# Altium project BusinessCard.PrjPcb
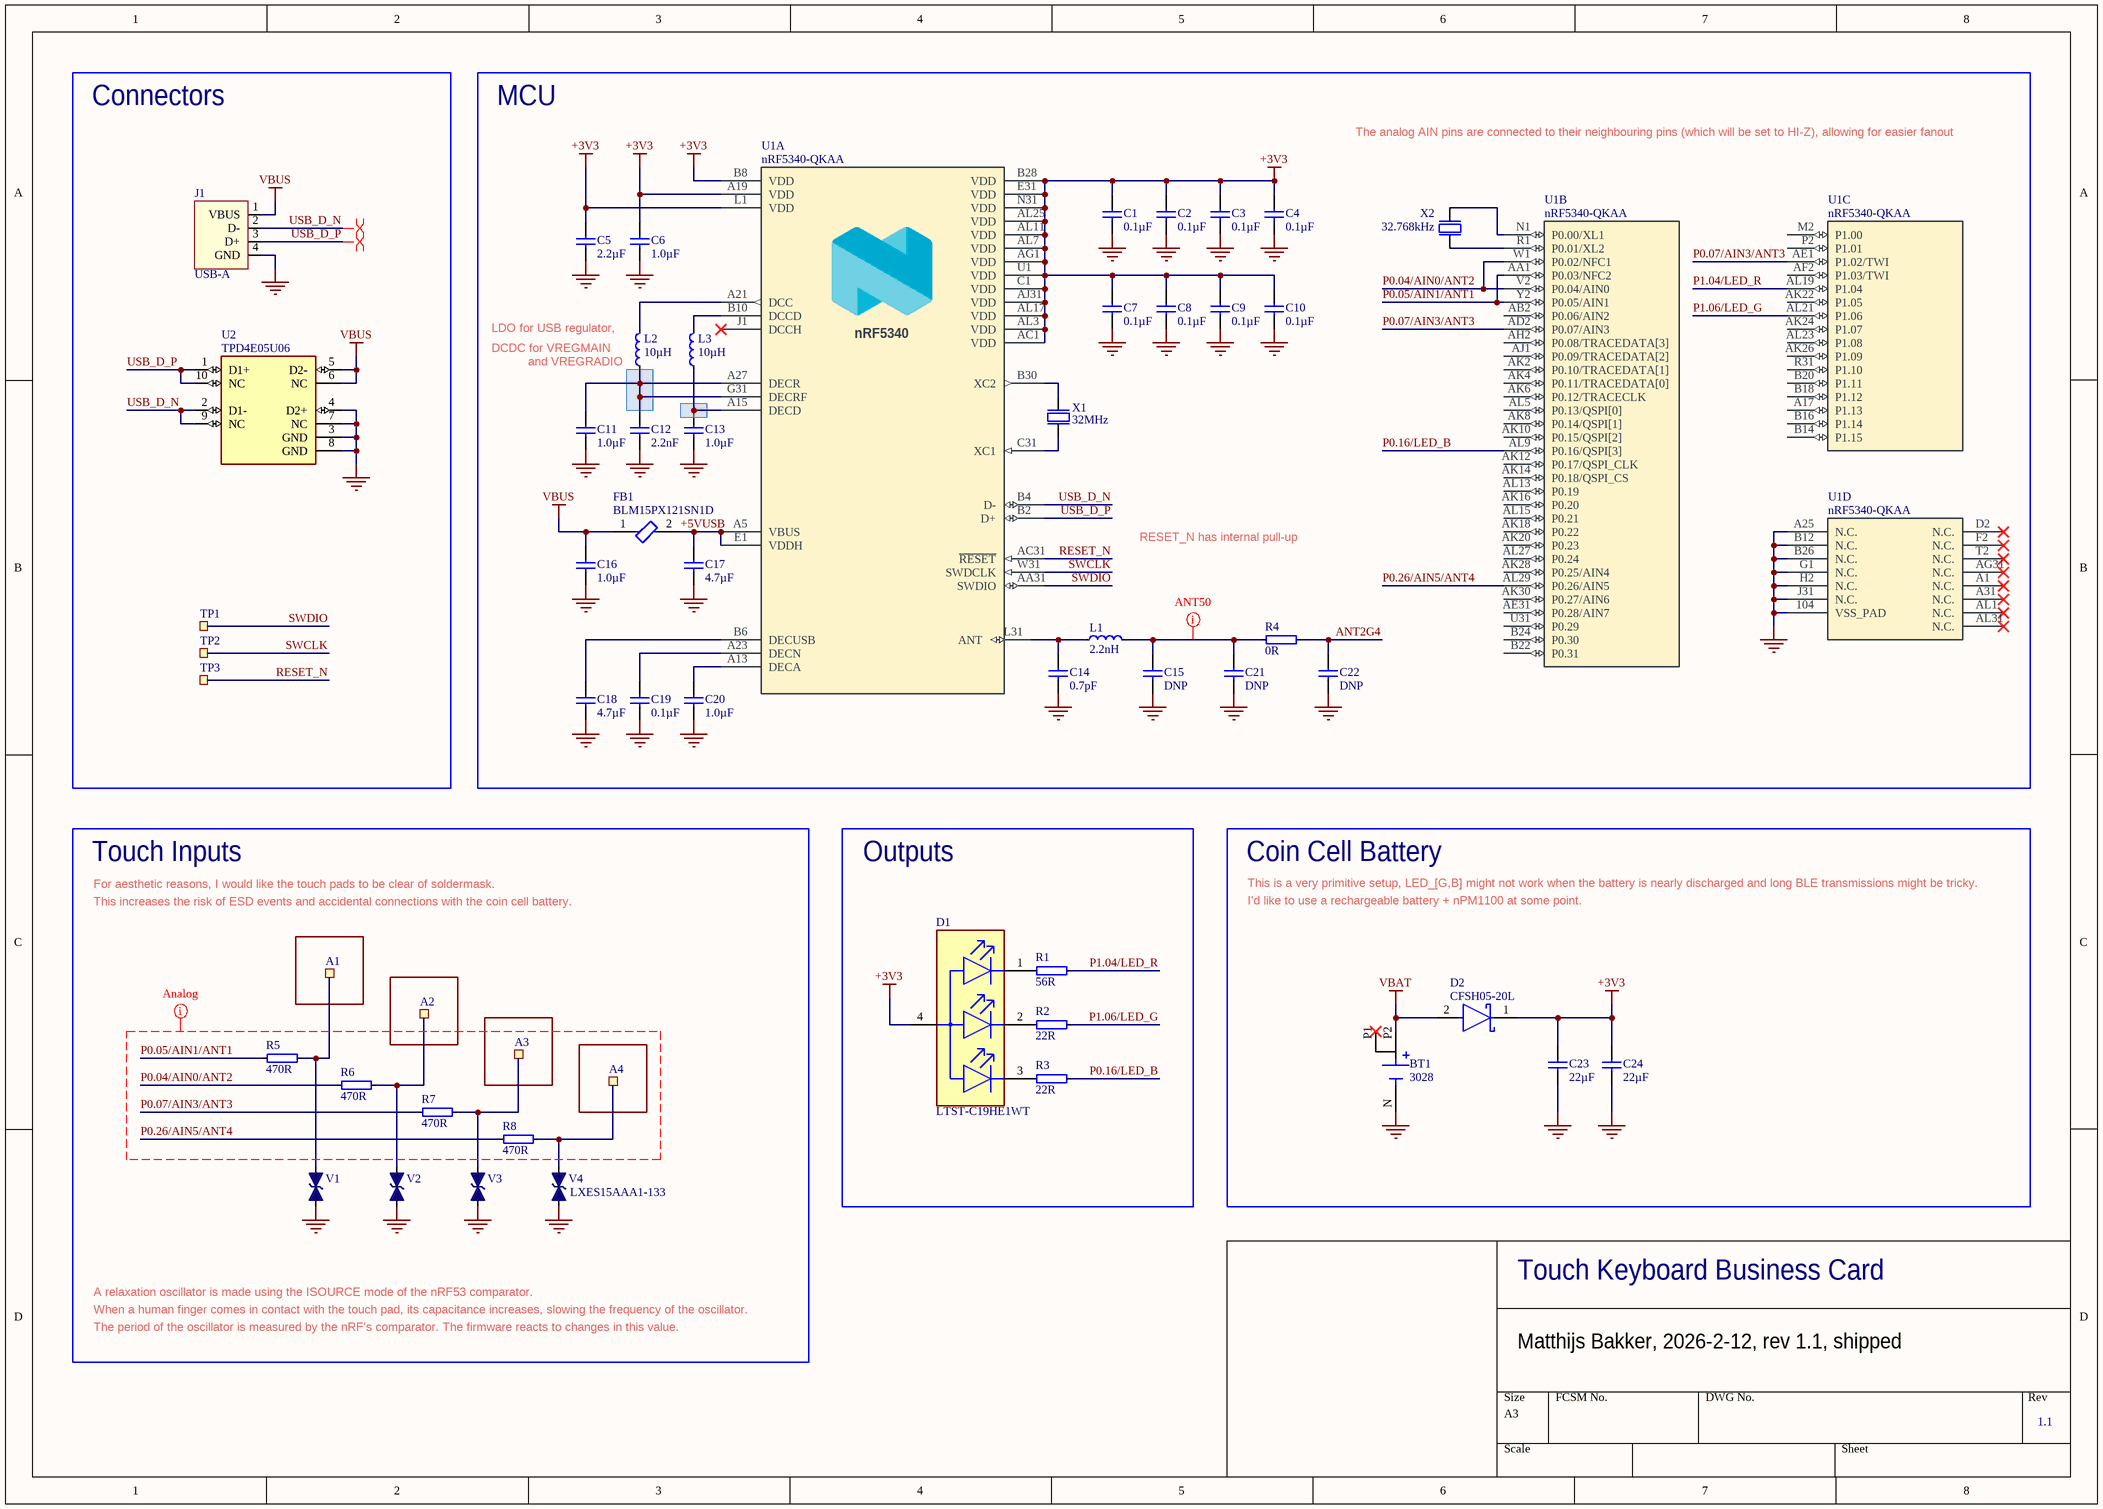
[diagram p0: BusinessCard.SchDoc]
1 sheet, 55 parts. Net scope: global (net labels, ports and power ports of the same name join across sheets).
Board file: BusinessCard.PcbDoc

## Sheet BusinessCard.SchDoc: Business Card
size A3; DrawnBy: Matthijs Bakker; SheetNumber: 1; SheetTotal: 1

### Parts
A1  Ø1.0mm,SMD  [TP_SMD_Ø1.0mm]  (value not drawn)  (no BOM)
A2  Ø1.0mm,SMD  [TP_SMD_Ø1.0mm]  (value not drawn)  (no BOM)
A3  Ø1.0mm,SMD  [TP_SMD_Ø1.0mm]  (value not drawn)  (no BOM)
A4  Ø1.0mm,SMD  [TP_SMD_Ø1.0mm]  (value not drawn)  (no BOM)
BT1  3028  [BAT_3028]
C1  0.1µF  [CAPC1005X04L]
C2  0.1µF  [CAPC1005X04L]
C3  0.1µF  [CAPC1005X04L]
C4  0.1µF  [CAPC1005X04L]
C5  2.2µF  [CAPC1005X04L]
C6  1.0µF  [CAPC1005X04L]
C7  0.1µF  [CAPC1005X04L]
C8  0.1µF  [CAPC1005X04L]
C9  0.1µF  [CAPC1005X04L]
C10  0.1µF  [CAPC1005X04L]
C11  1.0µF  [CAPC1005X04L]
C12  2.2nF  [CAPC1005X04L]
C13  1.0µF  [CAPC1005X04L]
C14  0.7pF  [CAPC1005X04L]
C15  DNP  [CAPC1005X04L]
C16  1.0µF  [CAPC1005X04L]
C17  4.7µF  [CAPC1608X06L]
C18  4.7µF  [CAPC1608X06L]
C19  0.1µF  [CAPC1005X04L]
C20  1.0µF  [CAPC1005X04L]
C21  DNP  [CAPC1005X04L]
C22  DNP  [CAPC1005X04L]
C23  22µF  [CAPC1608X06L]
C24  22µF  [CAPC1608X06L]
D1  LTST-C19HE1WT  [FP-LTST-C19HE1WT-MFG]
D2  CFSH05-20L  [FP-SOD-882L-MFG]
FB1  BLM15PX121SN1D  [FP-BLM15-0_05-d0_7-MFG]
J1  USB-A  [USB-A-PCB]  (no BOM)
L1  2.2nH  [INDC1005X04L]
L2  10µH  [INDC1608X06L]
L3  10µH  [INDC1608X06L]
R1  56R  [RESC1005X04L]
R2  22R  [RESC1005X04L]
R3  22R  [RESC1005X04L]
R4  0R  [RESC1005X04L]
R5  470R  [RESC1005X04L]
R6  470R  [RESC1005X04L]
R7  470R  [RESC1005X04L]
R8  470R  [RESC1005X04L]
TP1  Ø1.0mm,SMD  [TP_SMD_Ø1.0mm]  (value not drawn)  (no BOM)
TP2  Ø1.0mm,SMD  [TP_SMD_Ø1.0mm]  (value not drawn)  (no BOM)
TP3  Ø1.0mm,SMD  [TP_SMD_Ø1.0mm]  (value not drawn)  (no BOM)
U1  nRF5340-QKAA  [AQFN40P700X700X85_HS-99N]  (parts A,B,C,D of 4)
U2  TPD4E05U06  [FP-DQA0010A-MFG]
V1  LXES15AAA1-133  [RESC1005X04L]  (value not drawn)
V2  LXES15AAA1-133  [RESC1005X04L]  (value not drawn)
V3  LXES15AAA1-133  [RESC1005X04L]  (value not drawn)
V4  LXES15AAA1-133  [RESC1005X04L]
X1  32MHz  [BT-XTAL_1612]
X2  32.768kHz  [XTAL_2012]

### Blocks framed on the sheet
Connectors: J1 TP1-TP3 U2
MCU: C1-C22 FB1 L1-L3 R4 U1 X1 X2
Touch Inputs: A1-A4 R5-R8 V1-V4
Outputs: D1 R1-R3
Coin Cell Battery: BT1 C23 C24 D2

### Nets
+3V3: C1.2 C2.2 C3.2 C4.2 C5.2 C6.2 C7.2 C8.2 C9.2 C10.2 C23.2 C24.2 D1.4(A) D2.1(C) U1.A19(VDD) U1.AC1(VDD) U1.AG1(VDD) U1.AJ31(VDD) U1.AL3(VDD) U1.AL7(VDD) U1.AL11(VDD) U1.AL17(VDD) U1.AL25(VDD) U1.B8(VDD) U1.B28(VDD) U1.C1(VDD) U1.E31(VDD) U1.L1(VDD) U1.N31(VDD) U1.U1(VDD)
GND: BT1.N(NEG) C1.1 C2.1 C3.1 C4.1 C5.1 C6.1 C7.1 C8.1 C9.1 C10.1 C11.2 C12.1 C13.1 C14.1 C15.1 C16.2 C17.1 C18.1 C19.1 C20.1 C21.1 C22.1 C23.1 C24.1 J1.4(GND) U1.104(VSS_PAD) U1.A25(N.C.) U1.B12(N.C.) U1.B26(N.C.) U1.G1(N.C.) U1.H2(N.C.) U1.J31(N.C.) U2.3(GND) U2.4(D2+) U2.7(NC) U2.8(GND) V1.1 V2.1 V3.1 V4.1 X1.2(GND) X1.4(GND)
VBAT: BT1.P2(POS) D2.2(A)
VBUS: C16.1 FB1.1 J1.1(VBUS) U2.5(D2-) U2.6(NC)
+5VUSB: C17.2 FB1.2 U1.A5(VBUS) U1.E1(VDDH)
ANT2G4: C22.2 R4.2
P0.04/AIN0/ANT2: R6.1 U1.V2(P0.04/AIN0) U1.W1(P0.02/NFC1)
P0.05/AIN1/ANT1: R5.1 U1.AA1(P0.03/NFC2) U1.Y2(P0.05/AIN1)
P0.07/AIN3/ANT3: R7.1 U1.AD2(P0.07/AIN3) U1.AE1(P1.02/TWI)
P0.16/LED_B: R3.2 U1.AL9(P0.16/QSPI[3])
P0.26/AIN5/ANT4: R8.1 U1.AL29(P0.26/AIN5)
P1.04/LED_R: R1.2 U1.AL19(P1.04)
P1.06/LED_G: R2.2 U1.AL21(P1.06)
RESET_N: TP3.1 U1.AC31(~{RESET})
SWCLK: TP2.1 U1.W31(SWDCLK)
SWDIO: TP1.1 U1.AA31(SWDIO)
USB_D_N: J1.2(D-) U1.B4(D-) U2.2(D1-) U2.9(NC)
USB_D_P: J1.3(D+) U1.B2(D+) U2.1(D1+) U2.10(NC)
NetA1_1: A1.1 R5.2 V1.2
NetA2_1: A2.1 R6.2 V2.2
NetA3_1: A3.1 R7.2 V3.2
NetA4_1: A4.1 R8.2 V4.2
NetC11_1: C11.1 C12.2 L2.1 U1.A27(DECR) U1.G31(DECRF)
NetC13_2: C13.2 L3.1 U1.A15(DECD)
NetC14_2: C14.2 L1.1 U1.L31(ANT)
NetC15_2: C15.2 C21.2 L1.2 R4.1
NetC18_2: C18.2 U1.B6(DECUSB)
NetC19_2: C19.2 U1.A23(DECN)
NetC20_2: C20.2 U1.A13(DECA)
NetD1_1: D1.1(RED_C) R1.1
NetD1_2: D1.2(GREEN_C) R2.1
NetD1_3: D1.3(BLUE_C) R3.1
NetL2_2: L2.2 U1.A21(DCC)
NetL3_2: L3.2 U1.B10(DCCD)
NetU1_B30: U1.B30(XC2) X1.3(out)
NetU1_C31: U1.C31(XC1) X1.1(inp)
NetU1_N1: U1.N1(P0.00/XL1) X2.2(out)
NetU1_R1: U1.R1(P0.01/XL2) X2.1(inp)

Not connected (* = marked no-connect by the designer): BT1 P1(POS)*; U1 A1(N.C.)* A17(P1.13) A31(N.C.)* AB2(P0.06/AIN2) AE31(P0.28/AIN7) AF2(P1.03/TWI) AG31(N.C.)* AH2(P0.08/TRACEDATA[3]) AJ1(P0.09/TRACEDATA[2]) AK2(P0.10/TRACEDATA[1]) AK4(P0.11/TRACEDATA[0]) AK6(P0.12/TRACECLK) AK8(P0.14/QSPI[1]) AK10(P0.15/QSPI[2]) AK12(P0.17/QSPI_CLK) AK14(P0.18/QSPI_CS) AK16(P0.20) AK18(P0.22) AK20(P0.23) AK22(P1.05) AK24(P1.07) AK26(P1.09) AK28(P0.25/AIN4) AK30(P0.27/AIN6) AL1(N.C.)* AL5(P0.13/QSPI[0]) AL13(P0.19) AL15(P0.21) AL23(P1.08) AL27(P0.24) AL31(N.C.)* B14(P1.15) B16(P1.14) B18(P1.12) B20(P1.11) B22(P0.31) B24(P0.30) D2(N.C.)* F2(N.C.)* J1(DCCH)* M2(P1.00) P2(P1.01) R31(P1.10) T2(N.C.)* U31(P0.29)

### Layout directives
differential pair: USB_D_N, USB_D_P
net class Analog: P0.04/AIN0/ANT2, P0.05/AIN1/ANT1, P0.07/AIN3/ANT3, P0.26/AIN5/ANT4
net class ANT50: NetC15_2

### Notes on the sheet
- The analog AIN pins are connected to their neighbouring pins (which will be set to HI-Z), allowing for easier fanout
- (near L2) LDO for USB regulator,
- DCDC for VREGMAIN
- (near L2) and VREGRADIO
- RESET_N has internal pull-up
- For aesthetic reasons, I would like the touch pads to be clear of soldermask.
- This increases the risk of ESD events and accidental connections with the coin cell battery.
- This is a very primitive setup, LED_[G,B] might not work when the battery is nearly discharged and long BLE transmissions might be tricky.
- I'd like to use a rechargeable battery + nPM1100 at some point.
- A relaxation oscillator is made using the ISOURCE mode of the nRF53 comparator.
- When a human finger comes in contact with the touch pad, its capacitance increases, slowing the frequency of the oscillator.
- Touch Keyboard Business Card
- The period of the oscillator is measured by the nRF's comparator. The firmware reacts to changes in this value.
- Matthijs Bakker, 2026-2-12, rev 1.1, shipped
- 1.1
- (in symbol nRF5340-QKAA, part A) nRF5340

### Library data of the parts
A1-A4 TP1-TP3 = TESTPAD: 1.0mm circular SMD testpad; Manufacturer: Nordic Semiconductor; Artikkelnr Noca: N.A.; Part Number: TP_SMD_Ø1.0MM; Manufacturer Part Number: *; ComponentLink1URL: *; ComponentLink1Description: Datasheet; ComponentLink2URL: *; ComponentLink2Description: Supplier link; HelpURL: *; Footprint Doc: TP_SMD_Ø1.0mm; LatestRevisionDate: 2013-06-11; Pin Count: 1; Publisher: Nordic Semiconductor; Published: 2013-06-11; Value: Ø1.0mm,SMD; Note: *; Supplier 1: *; Supplier Part Number 1: *; Supplier 2: *; Supplier Part Number 2: *; Part number IPS: N.A.
BT1 = 3028: SMT Holder for 2012 Cell-Tin Nickel Plate | Keystone Electronics 3028; SnapEDA_Link: https://www.snapeda.com/parts/3028/Keystone/view-part/?ref=snap; Package: NON STANDARD-2 Keystone; Value: *; MF: Keystone Electronics; MP: 3028; Check_prices: https://www.snapeda.com/parts/3028/Keystone/view-part/?ref=eda
C1-C16 C19-C22 = CAP_0402: Capacitor, X5R, ±5%; Part Number: C0402-1µ0; LatestRevisionDate: 2016-08-22; Pin Count: 2; Publisher: Nordic Semiconductor; Published: 2009-05-08; Footprint Doc: 0402
  C1-C4 C7-C10 C19: Value: 0.1µF
  C5: Value: 2.2µF
  C6 C11 C13 C16 C20: Value: 1.0µF
  C12: Value: 2.2nF
  C14: Value: 0.7pF
  C15 C21 C22: Value: DNP
C17 C18 C23 C24 = CAP_0603: Capacitor, X7R, ±10%; Part Number: C0603-4µ7-6.3V-X7R; LatestRevisionDate: 2015-06-10; Pin Count: 2; Publisher: Nordic Semiconductor; Published: 2015-06-10; Footprint Doc: 0603
  C17 C18: Value: 4.7µF
  C23 C24: Value: 22µF
D1 = CMP-2000-05201-2: LED RGB DIFFUSED CHIP SMD; Number of LEDs: 3; Test Current: 20mA; Luminous Intensity: 180mcd; Lens Color: White; Dominant Wavelength: 470nm; Color: Blue; Reverse Voltage: 5V; Viewing Angle: 130°; Forward Voltage: 3.35V; Max Operating Temperature: 80°C; Packaging: Tape and Reel; Lens Transparency: Diffused; Width: 1.6mm; Case Code (Metric): 1616; Height: 0.35mm; Lens Style: Diffused; Mount: Surface Mount; Package Quantity: 3000; Radiation Hardening: No; Length: 1.6mm; Case/Package: 0606; Forward Current: 20mA; Case Code (Imperial): 0606; Lead Free: Lead Free; Min Operating Temperature: -20°C; Number of Elements: 3; Number of Pins: 4; Depth: 1.6mm
D2 = CMP-00647-58683154-1: CFSH05-20L TR PBFREE Rectifier Diode, Schottky, 1 Phase, 1 Element, 0.1A, 30V V(RRM); Schedule B: 8541100070, 8541100070; NexarPartId: 58683154; RoHS: Non-Compliant
FB1 = CMP-0686-00133-3: Chip Ferrite Bead, 0402, 120Ω @ 100MHz, 0.055Ω, 25%, 2A; Impedance: 120R; DC Resistance (DCR): 55mR; Number of Circuits: 1; Material: Steel; Lead Free: Lead Free; Package Quantity: 10000; Width: 0.5mm; Case Code (Metric): 1005; Test Frequency: 100MHz; Weight: 2.3E-05oz; Max DC Current: 2A; Current Rating: 2A; REACH SVHC: No SVHC; Case Code (Imperial): 0402; Min Operating Temperature: -55°C; Max Operating Temperature: 125°C; Max Current Rating: 2A; Series: EMIFIL®, BLM15P; Tolerance: 25%; Termination: SMD/SMT; Number of Lines: 1; Case/Package: 0402; RoHS Compliant: Yes; Number of Pins: 2; Length: 1mm; Height: 0.5mm; Packaging: Tape and Reel
J1 = USB-A-PCB: USB-A PCB footprint; Manufacturer: N.A.; Pad Count: 4; Part Number: USB-A-PCB; Manufacturer Part Number: N.A.; LatestRevisionDate: 2014-06-04; Published: 2014-06-04; Value: USB-A; Note: N.A.; Artikkelnr Noca: N.A.; Footprint Doc: USB-A-PCB; ComponentLink1Description: Datasheet; ComponentLink1URL: N.A.; ComponentLink2Description: Supplier link; ComponentLink2URL: N.A.; HelpURL: N.A.; Part number IPS: N.A.; Supplier 1: N.A.; Supplier Part Number 1: N.A.; Supplier 2: N.A.; Supplier Part Number 2: N.A.; PartId: 100500219; Component Class: Connectors; Author: rsk; Part number Norautron: N.A.
L1 = IND_0402: High frequency chip inductor ±10%; Part Number: L0402-2n2; LatestRevisionDate: 2012-09-19; Pin Count: 2; Publisher: Nordic Semiconductor; Published: 2010-07-12; Value: 2.2nH; Footprint Doc: 0402
L2 L3 = IND_0603: Chip inductor, IDC,min = 50 mA, ±20%; Part Number: L0603-10µ-TDK; LatestRevisionDate: 2012-09-19; Pin Count: 2; Publisher: Nordic Semiconductor; Published: 2019-05-06; Value: 10µH; Footprint Doc: 0603
R1 = RES: Resistor, ±1%, 0.063W; Part Number: R0402-56; Part number IPS: 00000002811; Note: Chip Res 1%; Artikkelnr Noca: 27049049; Manufacturer: *; Manufacturer Part Number: *; ComponentLink1URL: *; ComponentLink1Description: Datasheet; ComponentLink2URL: *; ComponentLink2Description: Supplier link; HelpURL: *; Footprint Doc: 0402; LatestRevisionDate: 2009-11-23; Pin Count: 2; Publisher: Nordic Semiconductor; Published: 2009-05-08; Value: 56R; Supplier 1: Farnell; Supplier Part Number 1: 173-8837; Supplier 2: *; Supplier Part Number 2: *
R2 R3 = RES: Resistor, ±1%, 0.063W; Part Number: R0402-22; Part number IPS: 00000002811; Note: Chip Res 1%; Artikkelnr Noca: 27049049; Manufacturer: *; Manufacturer Part Number: *; ComponentLink1URL: *; ComponentLink1Description: Datasheet; ComponentLink2URL: *; ComponentLink2Description: Supplier link; HelpURL: *; Footprint Doc: 0402; LatestRevisionDate: 2009-11-23; Pin Count: 2; Publisher: Nordic Semiconductor; Published: 2009-05-08; Value: 22R; Supplier 1: Farnell; Supplier Part Number 1: 173-8837; Supplier 2: *; Supplier Part Number 2: *
R4 = RES: Resistor, ±1%, 0.063W; Part Number: R0402-100; Part number IPS: 00000002811; Note: Chip Res 1%; Artikkelnr Noca: 27049049; Manufacturer: *; Manufacturer Part Number: *; ComponentLink1URL: *; ComponentLink1Description: Datasheet; ComponentLink2URL: *; ComponentLink2Description: Supplier link; HelpURL: *; Footprint Doc: 0402; LatestRevisionDate: 2009-11-23; Pin Count: 2; Publisher: Nordic Semiconductor; Published: 2009-05-08; Value: 0R; Supplier 1: Farnell; Supplier Part Number 1: 173-8837; Supplier 2: *; Supplier Part Number 2: *
R5-R8 = RES: Resistor, ±1%, 0.063W; Part Number: R0402-470; Part number IPS: 00000002811; Note: Chip Res 1%; Artikkelnr Noca: 27049049; Manufacturer: *; Manufacturer Part Number: *; ComponentLink1URL: *; ComponentLink1Description: Datasheet; ComponentLink2URL: *; ComponentLink2Description: Supplier link; HelpURL: *; Footprint Doc: 0402; LatestRevisionDate: 2009-11-23; Pin Count: 2; Publisher: Nordic Semiconductor; Published: 2009-05-08; Value: 470R; Supplier 1: Farnell; Supplier Part Number 1: 173-8837; Supplier 2: *; Supplier Part Number 2: *
U1 = nRF5340-QKAA: Multi-protocol Bluetooth Low Energy, IEEE 802.15.4, ANT and 2.4GHz proprietary system-on-chip; Pad Count: 98; Footprint Doc: AQFN-98; Value: nRF5340-QKAA; Component Class: nRF_Devices
U2 = CMP-04985-000004-1: TVS DIODE 5.5V 14V 10USON; Manufacturer Part Number: TPD4E05U06QDQARQ1; Manufacturer: Texas Instruments; Direction: Unidirectional; Standoff Height: 0mm; Capacitance: 0.5pF; Number Of Channels: 4; Breakdown Voltage: 6.4V; Peak Pulse Power: 2.5W; Automotive Grade: Grade 1; Value: 0.5pF; Interface: USB,Ethernet,LVDS,Other; Peak Pulse Current: 2.5A; Operating Supply Voltage: 5.5V; Reverse Standoff Voltage: 5.5V; Package: DQA0010A; Temperature Range Low: -40°C; Temperature Range High: +125°C; Ambient Temperature Range Low: -40°C; Device Class L1: Circuit Protection; Clamping Voltage: 14V; Device Class L2: ESD and Circuit Protection ICs; Octopart: https://octopart.com/tpd4e05u06qdqarq1-texas+instruments-48523459; Device Class L3: unset; Height: 0.55mm; Automotive: Yes; ComponentLink2Description: Datasheet; RoHS: TRUE; Ambient Temperature Range High: +125°C; Category: IC; Mouser Description: Automotive 4-Channel ESD Protection Solution for SuperSpeed (up to 5 Gbps) Interface 10-USON -40 to 125; Temperature: -40°C to +125°C; ComponentLink2URL: http://www.ti.com/lit/ds/symlink/tpd4e05u06-q1.pdf; Digikey Description: TVS DIODE 5.5V 14V 10USON; Lead Free: Yes
V1-V4 = D:SUPP: TVS DIODE 15VWM 0402; Manufacturer: Murata; Artikkelnr Noca: N.A.; Part Number: LXES15AAA1-133; Manufacturer Part Number: LXES15AAA1-133; ComponentLink1URL: *; ComponentLink1Description: Datasheet; ComponentLink2URL: *; ComponentLink2Description: Supplier link; HelpURL: http://www.murata.com/en-us/products/productdata/8796832759838/CRESD-E.pdf; Footprint Doc: 0402; LatestRevisionDate: 2017-09-20; Pin Count: 2; Publisher: Nordic Semiconductor; Published: 2017-09-20; Value: LXES15AAA1-133; Note: *; Supplier 1: Digi-Key; Supplier Part Number 1: 490-13209-6-ND; Supplier 2: Mouser; Supplier Part Number 2: 81-LXES15AAA1-133; Part number IPS: N.A.
X1 = XTAL_SMD1612: XTAL SMD 1612, 32MHz, Cl=8pF, Total Tol: ±40ppm; Part Number: XTAL_SMD1612_32MHz_8pF_General; LatestRevisionDate: 2016-08-19; Pin Count: 4; Publisher: Nordic Semiconductor; Published: 2016-08-19; Value: 32MHz; Footprint Doc: XTAL_1612
X2 = XTAL_SMD2012_32.768kHz_9pF_Seiko: XTAL SMD 2012, 32.768kHz, 9pF, ±20ppm; Manufacturer: Seiko Instruments; Manufacturer Part Number: SC20S-9.0PF20PPM; Part number IPS: 80000001425; Note: XTAL SMD 32.768kHz; Artikkelnr Noca: N.A.; Pad Count: 2; Part Number: XTAL_SMD2012_32.768kHz_9pF_Seiko; LatestRevisionDate: 2017-11-09; Published: 2015-10-15; Value: 32.768kHz; Footprint Doc: XTAL_2012; ComponentLink1Description: Datasheet; ComponentLink1URL: N.A.; ComponentLink2Description: Supplier link; ComponentLink2URL: N.A.; HelpURL: http://www.sii.co.jp/en/quartz/files/2013/03/file_PRODUCT_MASTER_50811_GRAPHIC03.pdf; Supplier 1: N.A.; Supplier Part Number 1: N.A.; Supplier 2: N.A.; Supplier Part Number 2: N.A.; PartId: 101600015; Component Class: Oscillators; Author: rsk; Part number Norautron: N.A.